# Altium project Notification.PrjPcb
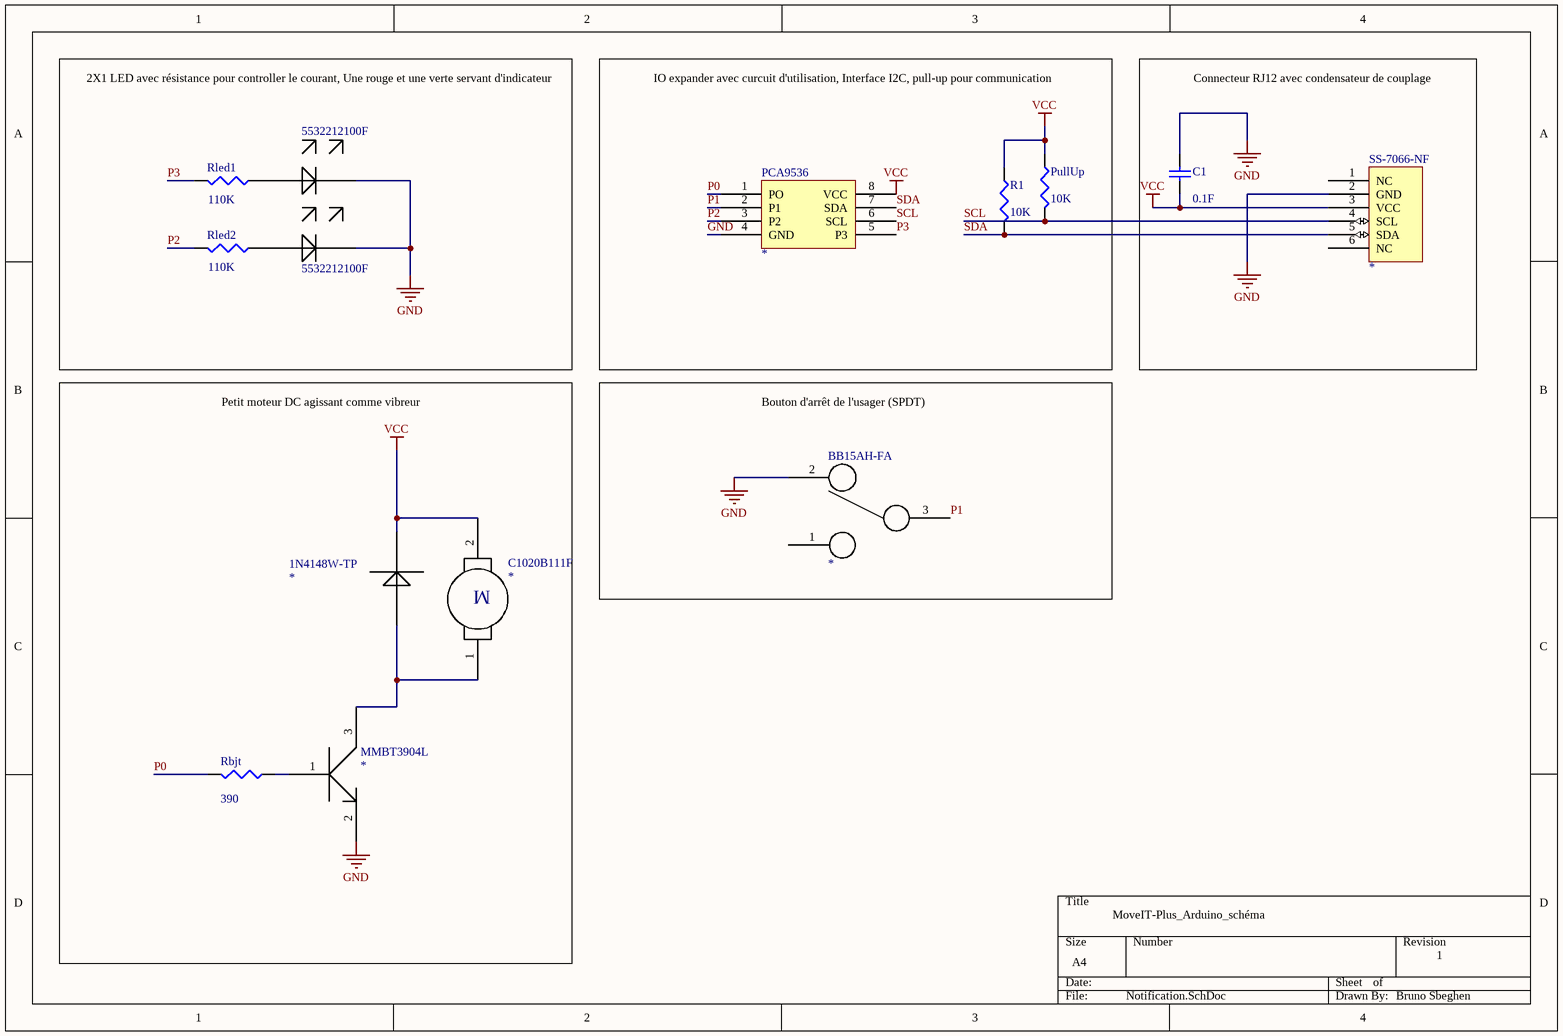
[diagram p0: Notification.SchDoc]
1 sheet, 13 parts. Net scope: global (net labels, ports and power ports of the same name join across sheets).
Board file: Notification.PcbDoc

## Sheet Notification.SchDoc
size A4

### Parts
1N4148W-TP  *  [1N4148W]
5532212100F  5532212100F  [5532212100F]
BB15AH-FA  *  [BB15AH-FA]
C1  value 0.1F  [C0805]  (hidden comment: Cap 0.1uF)
C1020B111F  *  [C1020B111F]
MMBT3904L  *  [MMBT3904LT3G]
PCA9536  *  [PCA9536]
PullUp  value 10K  [6-0805_N]  (hidden comment: Res 10K)
R1  value 10K  [6-0805_N]  (hidden comment: Res 10K)
Rbjt  value 390  [6-0805_N]  (hidden comment: Res 390)
Rled1  value 110K  [6-0805_N]  (hidden comment: Res 110)
Rled2  value 110K  [6-0805_N]  (hidden comment: Res 110)
SS-7066-NF  *  [SS-7066-NF]

### Blocks framed on the sheet
Connecteur RJ12 avec condensateur de couplage: C1 SS-7066-NF
Petit moteur DC agissant comme vibreur: 1N4148W-TP C1020B111F MMBT3904L Rbjt
Bouton d'arrêt de l'usager (SPDT): BB15AH-FA

### Nets
GND: 5532212100F.1 5532212100F.3 BB15AH-FA.2 C1.2 MMBT3904L.2 PCA9536.4(GND) SS-7066-NF.2(GND)
VCC: 1N4148W-TP.1 C1.1 C1020B111F.2 PCA9536.8(VCC) PullUp.1 R1.1 SS-7066-NF.3(VCC)
P0: PCA9536.1(PO) Rbjt.2
P1: BB15AH-FA.3 PCA9536.2(P1)
P2: PCA9536.3(P2) Rled2.2
P3: PCA9536.5(P3) Rled1.2
SCL: PCA9536.6(SCL) PullUp.2 SS-7066-NF.4(SCL)
SDA: PCA9536.7(SDA) R1.2 SS-7066-NF.5(SDA)
Net1N4148W-TP_2: 1N4148W-TP.2 C1020B111F.1 MMBT3904L.3
Net5532212100F_2: 5532212100F.2 Rled1.1
Net5532212100F_4: 5532212100F.4 Rled2.1
NetMMBT3904L_1: MMBT3904L.1 Rbjt.1

Not connected (* = marked no-connect by the designer): BB15AH-FA 1; SS-7066-NF 1(NC) 6(NC)

### Notes on the sheet
- 2X1 LED avec résistance pour controller le courant, Une rouge et une verte servant d'indicateur
- IO expander avec curcuit d'utilisation, Interface I2C, pull-up pour communication
- MoveIT-Plus_Arduino_schéma
- 1
- Bruno Sbeghen
- (in symbol C1020B111F) M

### Library data of the parts
1N4148W-TP = 1N4148W-TP: Diode; Supplier 1: Digi-Key; Supplier Part Number 1: 1N4148WTPMSCT-ND
5532212100F = 5532212100F: Double LED RG; Supplier 1: Digi-Key; Supplier Part Number 1: 350-3134-ND
BB15AH-FA = BB15AH-FA: Switch Push button ON SPDT; Supplier 1: Digi-Key; Supplier Part Number 1: 360-3265-ND
C1 = Cap 0.1uF: Capacitor 0.1uF; Published: 8-Jun-2000; LatestRevisionDate: 29-May-2009; LatestRevisionNote: IPC-7351 Footprint Added.; PackageReference: C1206; Publisher: Altium Limited; PackageDescription: Chip Capacitor; Supplier 1: Digi-Key; Supplier Part Number 1: 478-1395-1-ND
C1020B111F = C1020B111F: Small DC motor; Supplier 1: Digi-Key; Supplier Part Number 1: 1670-1005-ND
MMBT3904L = MMBT3904L: BJT NPN transistor; Supplier 1: Digi-Key; Supplier Part Number 1: MMBT3904LT3GOSCT-ND
PCA9536 = PCA9536: IO Expander; Supplier 1: Digi-Key; Supplier Part Number 1: 296-21765-1-ND
PullUp R1 = Res 10K: Resistor 10K; Published: 8-Jun-2000; LatestRevisionDate: 29-May-2009; LatestRevisionNote: IPC-7351 Footprint Added.; PackageReference: J1-0603; Publisher: Altium Limited; PackageDescription: Chip Resistor; Supplier 1: Digi-Key; Supplier Part Number 1: 311-10.0KCRCT-ND
Rbjt = Res 390: Resistor 390; Published: 8-Jun-2000; LatestRevisionDate: 29-May-2009; LatestRevisionNote: IPC-7351 Footprint Added.; PackageReference: J1-0603; Publisher: Altium Limited; PackageDescription: Chip Resistor; Supplier 1: Digi-Key; Supplier Part Number 1: 311-390GRCT-ND
Rled1 Rled2 = Res 110: Resistor 110; Published: 8-Jun-2000; LatestRevisionDate: 29-May-2009; LatestRevisionNote: IPC-7351 Footprint Added.; PackageReference: J1-0603; Publisher: Altium Limited; PackageDescription: Chip Resistor; Supplier 1: Digi-Key; Supplier Part Number 1: 311-110CRCT-ND
SS-7066-NF = SS-7066-NF: RJ12 Connector; Supplier 1: Digi-Key; Supplier Part Number 1: 380-1043-ND